# Altium schematic sheet Peripherals.SchDoc: Peripherals
size A4; Project: STM32MP15-DISCO PI; Date: Not used; ApprovedBy: Not used; CheckedBy: Not used; Author: Not used; CompanyName: STMicroelectronics; DrawnBy: Not used; Engineer: Not used; Organization: Not used; Address1: Not used; Address2: Not used; Address3: Not used; Address4: Not used; DocumentNumber: 15; Revision: Not used; SheetNumber: 15; SheetTotal: 17; CurrentTime: Not used; CurrentDate: Not used; Time: Not used; DocumentFullPathAndName: Not used; DocumentName: Not used; ModifiedDate: Not used; ImagePath: Not used; ProjectName: Not used; Application_BuildNumber: Not used
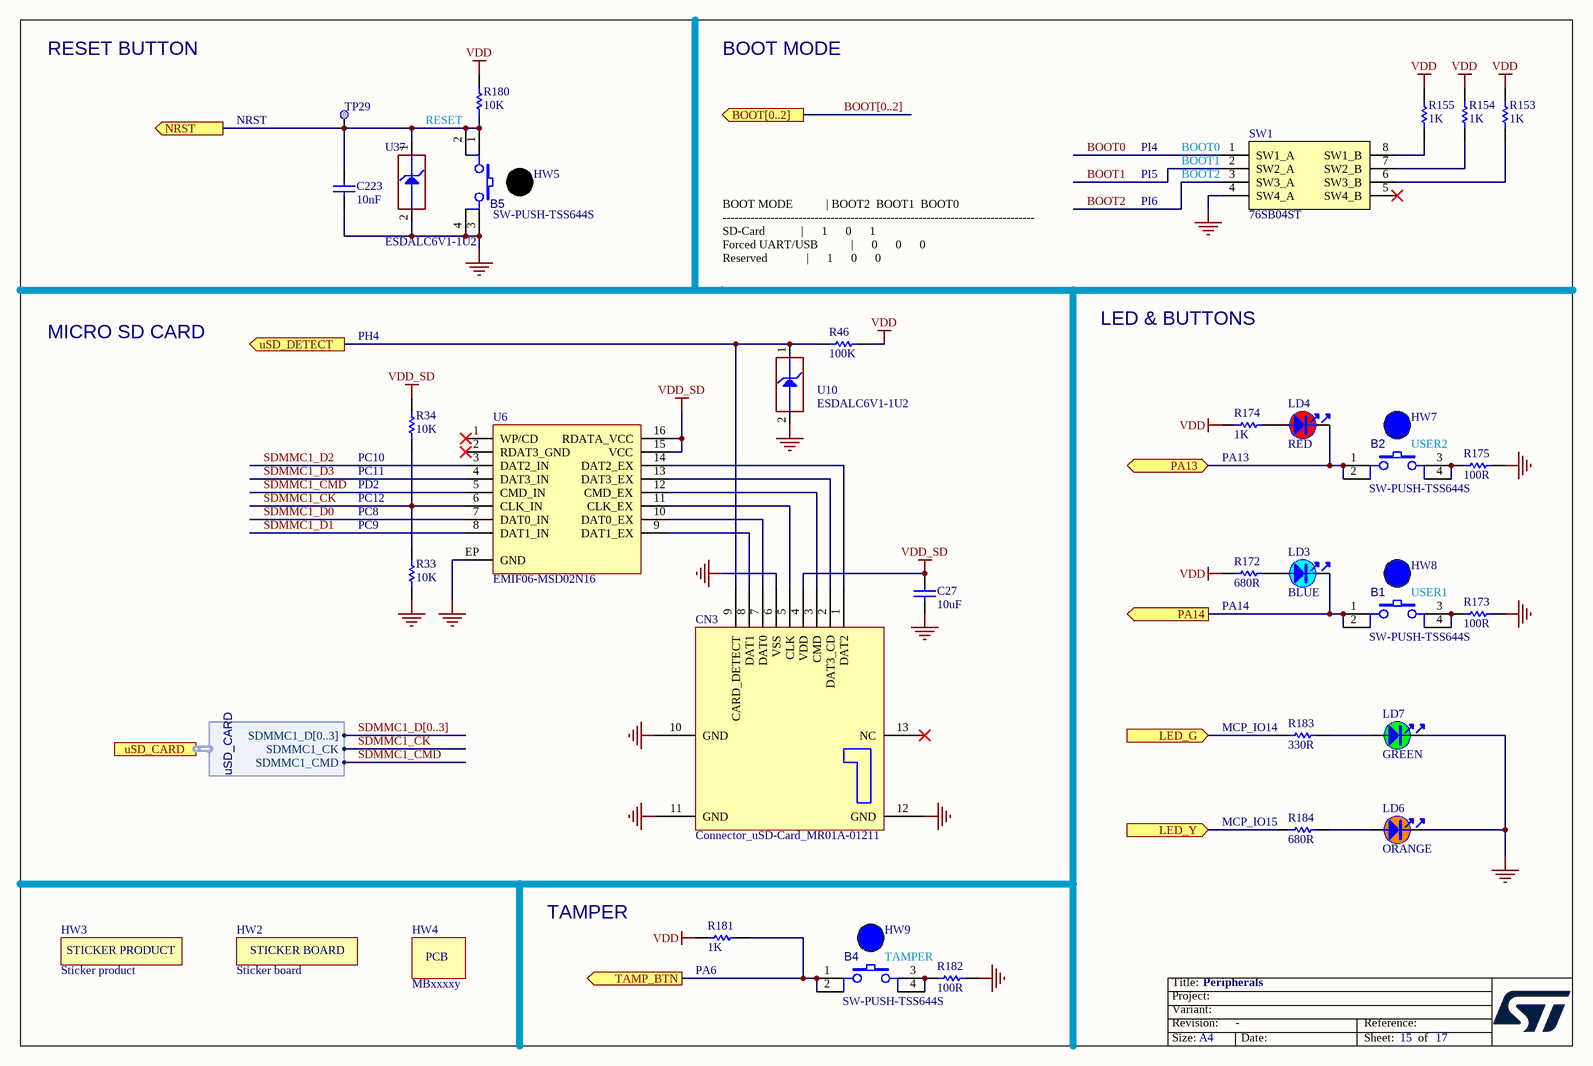
[diagram p0: Peripherals.SchDoc]

## Parts
B1  value SW-PUSH-TSS644S  [SWI_KNITTER_TSS644S]  (hidden comment: SW_PUSH_SMD)
B2  value SW-PUSH-TSS644S  [SWI_KNITTER_TSS644S]  (hidden comment: SW_PUSH_SMD)
B4  value SW-PUSH-TSS644S  [SWI_KNITTER_TSS644S]  (hidden comment: SW_PUSH_SMD)
B5  value SW-PUSH-TSS644S  [SWI_KNITTER_TSS644S]  (hidden comment: SW_PUSH_SMD)
C27  value 10uF  [C0603]  (hidden comment: Capacitor)
C223  value 10nF  [C0402]  (hidden comment: Capacitor)
CN3  value Connector_uSD-Card_MR01A-01211  [CON_MICROSD_ATOM_MR01A-01211]  (hidden comment: MR01A-01211)
HW2  value Sticker board  [STICKER_BOARD_25X9]  (hidden comment: STICKER_BOARD)  (no BOM)
HW3  value Sticker product  [STICKER_PRODUCT_25X9]  (hidden comment: STICKER_PRODUCT)  (no BOM)
HW4  value MBxxxxy  (hidden comment: PCB)  (mechanical)
HW5  SW-CAP-KTSC-62K  (value not drawn)  (mechanical)
HW7  Blue Hat  (value not drawn)  (mechanical)
HW8  Blue Hat  (value not drawn)  (mechanical)
HW9  Blue Hat  (value not drawn)  (mechanical)
LD3  value BLUE  [LED_0603_SMD-B_BLUE_H0P4]  (hidden comment: LED_blue)
LD4  value RED  [LED_0603_RED]  (hidden comment: LED_red)
LD6  value ORANGE  [LED_0603_ORANGE_H0P4]  (hidden comment: LED_orange)
LD7  value GREEN  [LED_0603_GREEN]  (hidden comment: LED_green)
R33  value 10K  [R0402]  (hidden comment: Resistor)
R34  value 10K  [R0402]  (hidden comment: Resistor)
R46  value 100K  [R0402]  (hidden comment: Resistor)
R153  value 1K  [R0402]  (hidden comment: Resistor)
R154  value 1K  [R0402]  (hidden comment: Resistor)
R155  value 1K  [R0402]  (hidden comment: Resistor)
R172  value 680R  [R0402]  (hidden comment: Resistor)
R173  value 100R  [R0402]  (hidden comment: Resistor)
R174  value 1K  [R0402]  (hidden comment: Resistor)
R175  value 100R  [R0402]  (hidden comment: Resistor)
R180  value 10K  [R0402]  (hidden comment: Resistor)
R181  value 1K  [R0402]  (hidden comment: Resistor)
R182  value 100R  [R0402]  (hidden comment: Resistor)
R183  value 330R  [R0402]  (hidden comment: Resistor)
R184  value 680R  [R0402]  (hidden comment: Resistor)
SW1  76SB04ST  [SWI_GRAYHILL-INC_76SB04ST]
TP29  Test Point  [TP_SMD_1MM]  (value not drawn)  (no BOM)
U6  EMIF06-MSD02N16  [ESD_UQFN16L-EPAD_3P5X1P2_P040]
U10  value ESDALC6V1-1U2  [ESD_ST0201]  (hidden comment: ESD-TRANSIL)
U37  value ESDALC6V1-1U2  [ESD_ST0201]  (hidden comment: ESD-TRANSIL)

## Ports
BOOT[0..2] (out), LED_G (in), LED_Y (in), NRST (out), PA13 (bidir), PA14 (out), TAMP_BTN (out), uSD_CARD (harness uSD_CARD), uSD_DETECT (out)

## Harnesses
uSD_CARD: SDMMC1_D[0..3], SDMMC1_CK, SDMMC1_CMD

## Nets
GND: B5.3 B5.4 C27.1 C223.1 CN3.6(VSS) CN3.10(GND) CN3.11(GND) CN3.12(GND) LD6.2 LD7.2 R33.1 R173.2 R175.2 R182.2 SW1.4(SW4_A) U6.EP(GND) U10.2(GND) U37.2(GND)
VDD: R46.1 R153.2 R154.2 R155.2 R172.2 R174.2 R180.2 R181.2
VDD_SD: C27.2 CN3.4(VDD) R34.2 U6.15(VCC) U6.16(RDATA_VCC)
BOOT0: SW1.1(SW1_A)
BOOT1: SW1.2(SW2_A)
BOOT2: SW1.3(SW3_A)
LED_G: R183.1 ; port LED_G
LED_Y: R184.1 ; port LED_Y
NRST: B5.1 B5.2 C223.2 R180.1 TP29.1 U37.1(IO1) ; port NRST
PA13: B2.1 B2.2 LD4.2 ; port PA13
PA14: B1.1 B1.2 LD3.2 ; port PA14
SDMMC1_CK: R33.2 R34.1 U6.6(CLK_IN) ; port uSD_CARD.SDMMC1_CK
SDMMC1_CMD: U6.5(CMD_IN) ; port uSD_CARD.SDMMC1_CMD
SDMMC1_D0: U6.7(DAT0_IN)
SDMMC1_D1: U6.8(DAT1_IN)
SDMMC1_D2: U6.3(DAT2_IN)
SDMMC1_D3: U6.4(DAT3_IN)
TAMP_BTN: B4.1 B4.2 R181.1 ; port TAMP_BTN
uSD_DETECT: CN3.9(CARD_DETECT) R46.2 U10.1(IO1) ; port uSD_DETECT
NetB1_3: B1.3 B1.4 R173.1
NetB2_3: B2.3 B2.4 R175.1
NetB4_3: B4.3 B4.4 R182.1
NetCN3_1: CN3.1(DAT2) U6.14(DAT2_EX)
NetCN3_2: CN3.2(DAT3_CD) U6.13(DAT3_EX)
NetCN3_3: CN3.3(CMD) U6.12(CMD_EX)
NetCN3_5: CN3.5(CLK) U6.11(CLK_EX)
NetCN3_7: CN3.7(DAT0) U6.10(DAT0_EX)
NetCN3_8: CN3.8(DAT1) U6.9(DAT1_EX)
NetLD3_1: LD3.1 R172.1
NetLD4_1: LD4.1 R174.1
NetLD6_1: LD6.1 R184.2
NetLD7_1: LD7.1 R183.2
NetR153_1: R153.1 SW1.6(SW3_B)
NetR154_1: R154.1 SW1.7(SW2_B)
NetR155_1: R155.1 SW1.8(SW1_B)

Not connected (* = marked no-connect by the designer): CN3 13(NC)*; SW1 5(SW4_B)*; U6 1(WP/CD)* 2(RDAT3_GND)*

## Buses and harness runs
bus BOOT[0..2] = port BOOT[0..2]
bus SDMMC1_D[0..3]

## Notes on the sheet
- RESET BUTTON
- BOOT MODE
- NRST
- RESET
- PI4
- PI5
- (near SW1) BOOT0
- (near SW1) BOOT1
- (near SW1) BOOT2
- BOOT MODE	          |	BOOT2 	BOOT1 	BOOT0
  ------------------------------------------------------------------------------
  SD-Card		          |	     1	     0	     1
  Forced UART/USB	          |	     0	     0	     0
  Reserved 		          |	     1	     0	     0
- PI6
- LED & BUTTONS
- MICRO SD CARD
- PH4
- (near R34) PC10
- (near R174) PA13
- (near B2) USER2
- (near R34) PC11
- PD2
- PC12
- PC8
- (near R33) PC9
- (near B1) USER1
- (near R172) PA14
- (near R183) MCP_IO14
- (near R184) MCP_IO15
- TAMPER
- (near R181) PA6
- Title:
- Project:
- Size:
- Revision:
- Variant:
- A4
- -
- Date:
- Reference:
- Sheet:
- of
- (in symbol MCD-00235) STICKER BOARD
- (in symbol MCD-00547) STICKER PRODUCT

## Library data of the parts
B1 B2 B4 = MCD-02417: Push Button, NO, 0.05A, 12V, 2.6N, SMD, 9.0x6.2mm, T=7.3mm, changeable caps KTSC-6xx; Part_Type: Misc; Manufacturer_Part_Number: TSS644S; Manufacturer: KNITTER-SWITCH; Part_Preference: Recommended; Component_Country_Of_Origin: China; ShowFields: YES; ID: 4523; Internal_Part_Number: MCD-02417; Status: Released; ComponentLink1URL: http://tunmcdsvn.tun.st.com/Component_Documentation_Library/Trunk/Misc/KNITTER_TSS6x_Series; Order_Code_Digikey: N/A; Order_Code_Farnell: N/A; Order_Code_RS: N/A; Package: 9.0x6.2mm
B5 = MCD-02417: Push Button, NO, 0.05A, 12V, 2.6N, SMD, 9.0x6.2mm, T=7.3mm, changeable caps KTSC-6xx; Manufacturer_Part_Number: TSS644S; Manufacturer: KNITTER-SWITCH; Part_Type: Misc; Part_Preference: Recommended; Component_Country_Of_Origin: China; ShowFields: YES; ID: 4523; Internal_Part_Number: MCD-02417; Status: Released; ComponentLink1URL: http://tunmcdsvn.tun.st.com/Component_Documentation_Library/Trunk/Misc/KNITTER_TSS6x_Series; Order_Code_Digikey: N/A; Order_Code_Farnell: N/A; Order_Code_RS: N/A; Package: 9.0x6.2mm
C27 = MCD-00099: Capacitor, MLCC, 10uF, 10V, X5R, +/-10%, 0603, T=0.8mm; Manufacturer_Part_Number: GRM188R61A106KE69D; Manufacturer: MURATA; Part_Preference: Recommended; Order_Code_RS: 170-6168; Component_Country_Of_Origin: Japan; ShowFields: YES; ID: 2770; Internal_Part_Number: MCD-00099; Status: Released; Part_Type: Capacitor; Package: 0603; ComponentLink1URL: http://tunmcdsvn.tun.st.com/Component_Documentation_Library/Trunk/Capacitor/MURATA_GRM_Series; Order_Code_Digikey: 490-10474-1-ND; Order_Code_Farnell: 2494233
C223 = MCD-02198: Capacitor, MLCC, 10nF, 50V, X7R, +/-10%, 0402, T=0.5mm; Manufacturer_Part_Number: CC0402KRX7R9BB103; Manufacturer: YAGEO; Part_Preference: Recommended; Order_Code_RS: 6169644; Component_Country_Of_Origin: China; ShowFields: YES; ID: 4298; Internal_Part_Number: MCD-02198; Status: Checked; Part_Type: Capacitor; Package: 0402; ComponentLink1URL: http://tunmcdsvn.tun.st.com/Component_Documentation_Library/Trunk/Capacitor/YAGEO_X7R_Series; Order_Code_Digikey: N/A; Order_Code_Farnell: N/A
CN3 = MCD-00653: Connector_uSD Card, Top Mnt Push-Push; Manufacturer: ATOM; Part_Preference: Recommended; Component_Country_Of_Origin: Unknown; ShowFields: YES; ID: 3087; Internal_Part_Number: MCD-00653; Manufacturer_Part_Number: MR01A-01211; Status: Released; Part_Type: Connector; ComponentLink1URL: http://tunmcdsvn.tun.st.com/Component_Documentation_Library/Trunk/Connector/ATOM_MR01A-01211/; Order_Code_Digikey: N/A; Order_Code_Farnell: N/A; Order_Code_RS: N/A
HW2 = MCD-00235: Sticker Board 25x9 mm; Part_Type: Misc; Part_Preference: Recommended; ShowFields: YES; ID: 2632; Internal_Part_Number: MCD-00235; Status: Released; Manufacturer_Part_Number: N/A; Manufacturer: N/A; ComponentLink1URL: N/A; Order_Code_Digikey: N/A; Order_Code_Farnell: N/A; Order_Code_RS: N/A
HW3 = MCD-00547: Sticker product 25x9 mm; Part_Type: Misc; Part_Preference: Recommended; ShowFields: YES; ID: 3197; Internal_Part_Number: MCD-00547; Status: Released; Manufacturer_Part_Number: N/A; Manufacturer: N/A; ComponentLink1URL: N/A; Order_Code_Digikey: N/A; Order_Code_Farnell: N/A; Order_Code_RS: N/A
HW4 = MCD-00216: PCB, xxxx for PCB number, Y for PCB revision; Part_Type: Misc; Part_Preference: Forbidden; ShowFields: YES; ID: 2653; Internal_Part_Number: MCD-00216; Status: Released; Manufacturer: N/A; Manufacturer_Part_Number: n/a
HW5 = MCD-02420: Black round cap for TSS6x series; Part_Type: Mechanical; Part_Preference: Recommended; Manufacturer: KNITTER-SWITCH; Component_Country_Of_Origin: China; ShowFields: YES; ID: 4526; Value: SW-CAP-KTSC-62K; Order_code_Digikey: N/A; Order_code_Farnell: N/A; Order_code_RS: N/A; Status: Released; ComponentLink1URL: http://tunmcdsvn.tun.st.com/Component_Documentation_Library/Trunk/Mechanical/KNITTER-SWITCH_KTSC-62_Series; Internal_Part_Number: MCD-02420; Manufacturer_Part_Number: KTSC-62K
HW7-HW9 = MCD-02136: Switch hat, blue, For KTSC-62B; Part_Type: Misc; Part_Preference: Recommended; Manufacturer: APEM INC; Manufacturer_Part_Number: AKTSC62B; Order_Code_RS: 378-6779; Component_Country_Of_Origin: Unknown; ShowFields: YES; ID: 4236; Value: Blue Hat; Order_Code_Digikey: AKTSC62B-ND; Order_Code_Farnell: N/A; Status: Released; ComponentLink1URL: http://tunmcdsvn.tun.st.com/Component_Datasheet_Library/Trunk/Mechanical/APEM_BLUEHAT_KTSC62; Internal_Part_Number: MCD-02136
LD3 = MCD-01131: LED Blue, 0603 SMD, Forward Voltage Min=2,8V, Max=3,1V; Part_Type: Display; Manufacturer_Part_Number: 19-217-BHC-ZL1M2RY-3T; Manufacturer: EVERLIGHT; Part_Preference: Forbidden; Component_Country_Of_Origin: China; ShowFields: YES; ID: 3365; Internal_Part_Number: MCD-01131; Status: Obsolete; Package: 0603; ComponentLink1URL: http://tunmcdsvn.tun.st.com/Component_Datasheet_Library/Trunk/Display/Everlight_SMD-LED-BLUE_19-213BHC-ZK1L2B11X-3T/Everlight_SMD-LED-BLUE_19-217-BHC-ZL1M2RY-3T-V4.pdf
LD4 = MCD-00049: LED, Red, 0603; Manufacturer_Part_Number: 19-213-R6C-AP1Q2B/3T; Manufacturer: EVERLIGHT; Part_Type: Display; Part_Preference: Forbidden; Component_Country_Of_Origin: China; ShowFields: YES; ID: 2543; Internal_Part_Number: MCD-00049; Status: Obsolete; ComponentLink1URL: http://tunmcdsvn.tun.st.com/Component_Datasheet_Library/Trunk/Display/Everlight_SMD-LED-RED_19-213-R6C-AP1Q2B-3T-V3.doc; Package: LED 0603
LD6 = MCD-00321: LED, Orange, 0603; Part_Type: Display; Manufacturer_Part_Number: 19-217/S2C-AM2N2VY/3T; Manufacturer: EVERLIGHT; Part_Preference: Forbidden; Component_Country_Of_Origin: China; ShowFields: YES; ID: 2957; Internal_Part_Number: MCD-00321; Status: Obsolete; Package: LED 0603; ComponentLink1URL: http://tunmcdsvn.tun.st.com/Component_Datasheet_Library/Trunk/Display/Everlight_SMD-LED-Orange_19-217-S2C-AM2N2VY-3T_V1
LD7 = MCD-00050: LED, Green, 0603; Manufacturer_Part_Number: 19-213SYGC/S530-E2/TR8; Manufacturer: EVERLIGHT; Part_Type: Display; Part_Preference: Forbidden; Component_Country_Of_Origin: China; ShowFields: YES; ID: 2542; Internal_Part_Number: MCD-00050; Status: Obsolete; ComponentLink1URL: http://tunmcdsvn.tun.st.com/Component_Datasheet_Library/Trunk/Display/Everlight_SMD-LED-GREEN_19-213SYGC-S530-XX-TR8-v3.doc; Package: LED 0603
R33 R34 R180 = MCD-00053: Resistor, 10K, 0402, +/-1%, 1/16W; Manufacturer_Part_Number: RC0402FR-0710KL; Manufacturer: YAGEO; BMS_Part_Number: 9131590; Part_Preference: Recommended; Component_Country_Of_Origin: China; ShowFields: YES; ID: 2539; Internal_Part_Number: MCD-00053; Status: Released; Part_Type: Resistor; ComponentLink1URL: http://tunmcdsvn.tun.st.com/Component_Documentation_Library/Trunk/Resistor/YAGEO_RC_L_Series; Package: 0402; Order_Code_Digikey: 311-10.0KLRCT-ND; Order_Code_Farnell: 9239359; Order_Code_RS: N/A
R46 = MCD-00059: Resistor, 100K, 0402, +/-1%, 1/16W; Part_Preference: Recommended; Manufacturer: YAGEO; Manufacturer_Part_Number: RC0402FR-07100KL; Component_Country_Of_Origin: China; ShowFields: YES; ID: 2533; Internal_Part_Number: MCD-00059; Status: Released; Part_Type: Resistor; Package: 0402; ComponentLink1URL: http://tunmcdsvn.tun.st.com/Component_Documentation_Library/Trunk/Resistor/YAGEO_RC_L_Series; Order_Code_Digikey: 311-100KLRTR-ND; Order_Code_Farnell: 2421891; Order_Code_RS: N/A
R153-R155 R174 R181 = MCD-00061: Resistor, 1K, 0402, +/-1%,1/16W; Manufacturer_Part_Number: RC0402FR-071KL; Manufacturer: YAGEO; Part_Preference: Recommended; Component_Country_Of_Origin: China; ShowFields: YES; ID: 2532; Internal_Part_Number: MCD-00061; Status: Released; Part_Type: Resistor; ComponentLink1URL: http://tunmcdsvn.tun.st.com/Component_Documentation_Library/Trunk/Resistor/YAGEO_RC_L_Series; Package: 0402; Order_Code_Digikey: 311-1.00KLRCT-ND; Order_Code_Farnell: 9239235; Order_Code_RS: N/A
R172 R184 = MCD-00507: Resistor, 680R, 0402, +/-1%, 1/16W; Manufacturer_Part_Number: RC0402FR-07680RL; Manufacturer: YAGEO; Part_Preference: Recommended; Component_Country_Of_Origin: China; ShowFields: YES; ID: 3238; Internal_Part_Number: MCD-00507; Status: Released; Part_Type: Resistor; ComponentLink1URL: http://tunmcdsvn.tun.st.com/Component_Documentation_Library/Trunk/Resistor/YAGEO_RC_L_Series; Package: 0402; Order_Code_Digikey: 311-680LRCT-ND; Order_Code_Farnell: 9239219; Order_Code_RS: N/A
R173 R175 R182 = MCD-00067: Resistor, 100R, 0402, +/- 1%, 1/16W; Manufacturer_Part_Number: RC0402FR-07100RL; Manufacturer: YAGEO; Part_Preference: Recommended; Component_Country_Of_Origin: China; ShowFields: YES; ID: 2527; Internal_Part_Number: MCD-00067; Status: Released; Part_Type: Resistor; ComponentLink1URL: http://tunmcdsvn.tun.st.com/Component_Documentation_Library/Trunk/Resistor/YAGEO_RC_L_Series; Package: 0402; Order_Code_Digikey: 311-100LRCT-ND; Order_Code_Farnell: 9239111; Order_Code_RS: N/A
R183 = MCD-00062: Resistor, 330R, 0402, +/-1%, 1/16W; Manufacturer_Part_Number: RC0402FR-07330RL; Manufacturer: YAGEO; Part_Preference: Recommended; Component_Country_Of_Origin: China; ShowFields: YES; ID: 2529; Internal_Part_Number: MCD-00062; Status: Released; Part_Type: Resistor; Package: 0402; ComponentLink1URL: http://tunmcdsvn.tun.st.com/Component_Documentation_Library/Trunk/Resistor/YAGEO_RC_L_Series; Order_Code_Digikey: 311-330LRCT-ND; Order_Code_Farnell: 9239170; Order_Code_RS: N/A
SW1 = MCD-02256: Quad SPST switch, TH, 2.54mm pitch, height 7.5mm; Part_Preference: Recommended; Part_Type: Misc; Manufacturer: GRAYHILL; Order_Code_RS: 878-0230; Component_Country_Of_Origin: China; ShowFields: YES; ID: 4356; ComponentLink1URL: http://tunmcdsvn.tun.st.com/Component_Datasheet_Library/Trunk/Misc/GRAYHILL_DIP_Series_76_SPST; Internal_Part_Number: MCD-02256; Value: 76SB04ST; Status: Released; Manufacturer_Part_Number: 76SB04ST; Package: DIP8 2.54mm pitch; Order_Code_Digikey: GH7169-ND; Order_Code_Farnell: 9479007
TP29 = MCD-00074: Test Point 1mm; Part_Type: Misc; Part_Preference: Recommended; ShowFields: YES; ID: 2518; Internal_Part_Number: MCD-00074; Status: Released; Manufacturer_Part_Number: N/A; Manufacturer: N/A; ComponentLink1URL: http://na; Order_Code_Digikey: N/A; Order_Code_Farnell: N/A; Order_Code_RS: N/A
U6 = MCD-00249: ESD protection for SD card 2.0; BMS_Part_Number: 9179003; Part_Preference: Recommended; Part_Type: Diode; Manufacturer: STMICROELECTRONICS; Manufacturer_HQ_COO: EU; Order_Code_RS: 165-8188; Component_Country_Of_Origin: Thailand; ShowFields: YES; ID: 2617; Internal_Part_Number: MCD-00249; Value: EMIF06-MSD02N16; Status: Released; Manufacturer_Part_Number: EMIF06-MSD02N16; ComponentLink1URL: http://tunmcdsvn.tun.st.com/Component_Datasheet_Library/Trunk/Diodes/STM_ESD_EMIF06-MSD02N16; Order_Code_Digikey: 497-8751-2-ND; Order_Code_Farnell: 2341664
U10 U37 = MCD-00170: ESD protection 6V1; Part_Type: Diode; Manufacturer: STMICROELECTRONICS; BMS_Part_Number: 9151132; Part_Preference: Recommended; Manufacturer_HQ_COO: EU; Component_Country_Of_Origin: China; ShowFields: YES; ID: 2696; Internal_Part_Number: MCD-00170; Status: Released; Manufacturer_Part_Number: ESDALC6V1-1U2; ComponentLink1URL: http://tunmcdsvn.tun.st.com/Component_Datasheet_Library/Trunk/Diodes/STM_ESD_ESDALC6V1-1U2